# EAGLE schematic pc (EAGLE 9.6.2)
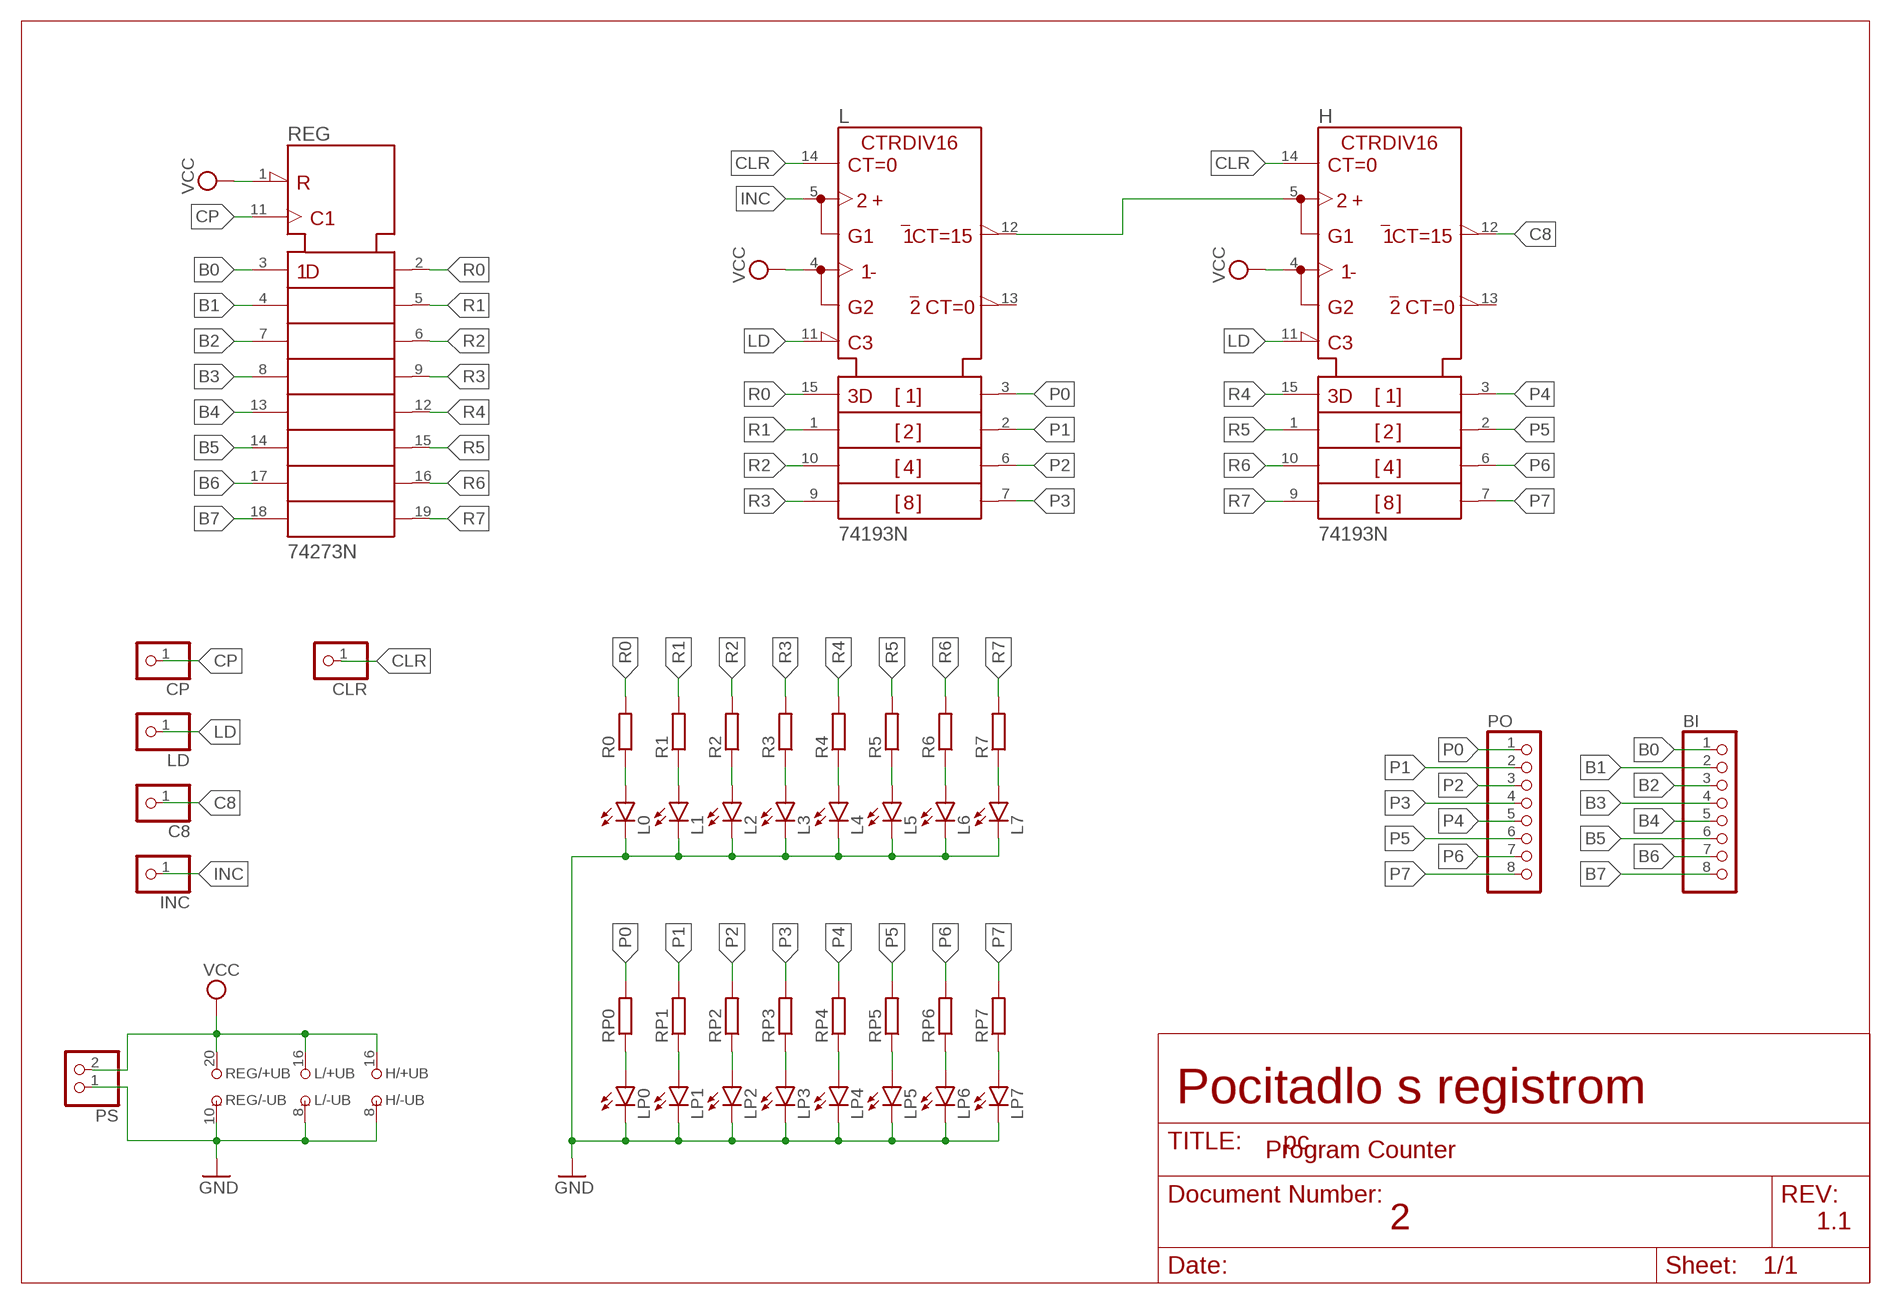
[diagram p0: schematic, sheet 1]

## Parts
BI  PINHD-1X8  [1X08]
C8  PINHD-1X1  [1X01]
CLR  PINHD-1X1  [1X01]
CP  PINHD-1X1  [1X01]
H  74193N  [DIL16]
INC  PINHD-1X1  [1X01]
L  74193N  [DIL16]
L0  LED5MM  [LED5MM]
L1  LED5MM  [LED5MM]
L2  LED5MM  [LED5MM]
L3  LED5MM  [LED5MM]
L4  LED5MM  [LED5MM]
L5  LED5MM  [LED5MM]
L6  LED5MM  [LED5MM]
L7  LED5MM  [LED5MM]
LD  PINHD-1X1  [1X01]
LP0  LED5MM  [LED5MM]
LP1  LED5MM  [LED5MM]
LP2  LED5MM  [LED5MM]
LP3  LED5MM  [LED5MM]
LP4  LED5MM  [LED5MM]
LP5  LED5MM  [LED5MM]
LP6  LED5MM  [LED5MM]
LP7  LED5MM  [LED5MM]
PO  PINHD-1X8  [1X08]
PS  PINHD-1X2  [1X02]
R0  R-EU_0204/7  [0204/7]
R1  R-EU_0204/7  [0204/7]
R2  R-EU_0204/7  [0204/7]
R3  R-EU_0204/7  [0204/7]
R4  R-EU_0204/7  [0204/7]
R5  R-EU_0204/7  [0204/7]
R6  R-EU_0204/7  [0204/7]
R7  R-EU_0204/7  [0204/7]
REG  74273N  [DIL20]
RP0  R-EU_0204/7  [0204/7]
RP1  R-EU_0204/7  [0204/7]
RP2  R-EU_0204/7  [0204/7]
RP3  R-EU_0204/7  [0204/7]
RP4  R-EU_0204/7  [0204/7]
RP5  R-EU_0204/7  [0204/7]
RP6  R-EU_0204/7  [0204/7]
RP7  R-EU_0204/7  [0204/7]

## Nets
B0: BI.1 REG.3(1D)
B1: BI.2 REG.4(2D)
B2: BI.3 REG.7(3D)
B3: BI.4 REG.8(4D)
B4: BI.5 REG.13(5D)
B5: BI.6 REG.14(6D)
B6: BI.7 REG.17(7D)
B7: BI.8 REG.18(8D)
C8: C8.1 H.12(!CO)
CLR: CLR.1 H.14(CLR) L.14(CLR)
CP: CP.1 REG.11(CLK)
GND: H.8(-UB) L0.K(C) L1.K(C) L2.K(C) L3.K(C) L4.K(C) L5.K(C) L6.K(C) L7.K(C) L.8(-UB) LP0.K(C) LP1.K(C) LP2.K(C) LP3.K(C) LP4.K(C) LP5.K(C) LP6.K(C) LP7.K(C) PS.1 REG.10(-UB)
INC: INC.1 L.5(UP)
LD: H.11(!LOAD) L.11(!LOAD) LD.1
N$17: L0.A R0.1
N$20: L1.A R1.1
N$21: H.5(UP) L.12(!CO)
N$24: L2.A R2.1
N$27: L3.A R3.1
N$45: LP0.A RP0.1
N$48: LP1.A RP1.1
N$51: LP2.A RP2.1
N$54: LP3.A RP3.1
N$57: LP4.A RP4.1
N$60: LP5.A RP5.1
N$63: LP6.A RP6.1
N$66: LP7.A RP7.1
N$70: L4.A R4.1
N$73: L5.A R5.1
N$76: L6.A R6.1
N$79: L7.A R7.1
P0: L.3(QA) PO.1 RP0.2
P1: L.2(QB) PO.2 RP1.2
P2: L.6(QC) PO.3 RP2.2
P3: L.7(QD) PO.4 RP3.2
P4: H.3(QA) PO.5 RP4.2
P5: H.2(QB) PO.6 RP5.2
P6: H.6(QC) PO.7 RP6.2
P7: H.7(QD) PO.8 RP7.2
R0: L.15(A) R0.2 REG.2(1Q)
R1: L.1(B) R1.2 REG.5(2Q)
R2: L.10(C) R2.2 REG.6(3Q)
R3: L.9(D) R3.2 REG.9(4Q)
R4: H.15(A) R4.2 REG.12(5Q)
R5: H.1(B) R5.2 REG.15(6Q)
R6: H.10(C) R6.2 REG.16(7Q)
R7: H.9(D) R7.2 REG.19(8Q)
VCC: H.4(DOWN) H.16(+UB) L.4(DOWN) L.16(+UB) PS.2 REG.1(!CLR) REG.20(+UB)
Unconnected: H.13(!BO) L.13(!BO)

## Notes on the sheet
- Pocitadlo s registrom
- Program Counter
- 2 | 1.1

## Library data of the parts
BI PO = pinhead:PINHD-1X8: PIN HEADER
C8 CLR CP INC LD = pinhead:PINHD-1X1: PIN HEADER
H L = 74ttl-din:74*193: Synchronus 4-bit up down COUNTER
L0 L1-L7 LP0 LP1-LP7 = led:LED: LED OSRAM: - CHIPLED LG R971, LG N971, LY N971, LG Q971, LY Q971, LO R971, LY R971 LH N974, LH R974 LS Q976, LO Q976, LY Q976 LO Q996 - Hyper CHIPLED LW Q18S LB Q993, LB Q99A, LB R99A - SideLED LS A670, LO A670, LY A670, LG A670, LP A670 LB A673, LV A673, LT A673, LW A673 LH A674 LY A675 LS A676, LA A676, LO A676, LY A676, LW A676 LS A679, LY A679, LG A679 - Hyper Micro SIDELED® LS Y876, LA Y876, LO Y876, LY Y876 LT Y87S - SmartLED LW L88C, LW L88S LB L89C, LB L89S, LG L890 LS L89K, LO L89K, LY L89K LS L896, LA L896, LO L896, LY L896 - TOPLED LS T670, LO T670, LY T670, LG T670, LP T670 LSG T670, LSP T670, LSY T670, LOP T670, LYG T670 LG T671, LOG T671, LSG T671 LB T673, LV T673, LT T673, LW T673 LH T674 LS T676, LA T676, LO T676, LY T676, LB T676, LH T676, LSB T676, LW T676 LB T67C, LV T67C, LT T67C, LS T67K, LO T67K, LY T67K, LW E67C LS E67B, LA E67B, LO E67B, LY E67B, LB E67C, LV E67C, LT E67C LW T67C LS T679, LY T679, LG T679 LS T770, LO T770, LY T770, LG T770, LP T770 LB T773, LV T773, LT T773, LW T773 LH T774 LS E675, LA E675, LY E675, LS T675 LS T776, LA T776, LO T776, LY T776, LB T776 LHGB T686 LT T68C, LB T68C - Hyper Mini TOPLED® LB M676 - Mini TOPLED Santana® LG M470 LS M47K, LO M47K, LY M47K Source: http://www.osram.convergy.de LUXEON: - LUMILED® LXK2-PW12-R00, LXK2-PW12-S00, LXK2-PW14-U00, LXK2-PW14-V00 LXK2-PM12-R00, LXK2-PM12-S00, LXK2-PM14-U00 LXK2-PE12-Q00, LXK2-PE12-R00, LXK2-PE12-S00, LXK2-PE14-T00, LXK2-PE14-U00 LXK2-PB12-K00, LXK2-PB12-L00, LXK2-PB12-M00, LXK2-PB14-N00, LXK2-PB14-P00, LXK2-PB14-Q00 LXK2-PR12-L00, LXK2-PR12-M00, LXK2-PR14-Q00, LXK2-PR14-R00 LXK2-PD12-Q00, LXK2-PD12-R00, LXK2-PD12-S00 LXK2-PH12-R00, LXK2-PH12-S00 LXK2-PL12-P00, LXK2-PL12-Q00, LXK2-PL12-R00 Source: www.luxeon.com KINGBRIGHT: KA-3528ASYC Source: www.kingbright.com
PS = pinhead:PINHD-1X2: PIN HEADER
R0 R1-R7 RP0 RP1-RP7 = rcl:R-EU_: RESISTOR, European symbol; SPICEPREFIX: R
REG = 74ttl-din:74*273: Octal D type FLIP FLOP, clear